# Altium schematic sheet E-43 Inertial sensor.SchDoc: E-43 Inertial Sensor
size B; DrawnBy: Jeremie Boulianne; Organization: Synthiam Inc.; Address1: Unit 10, 6120 - 11 St. SE; Address2: Calgary, AB; Address3: T2H 2L7; Address4: Canada; Revision: 0
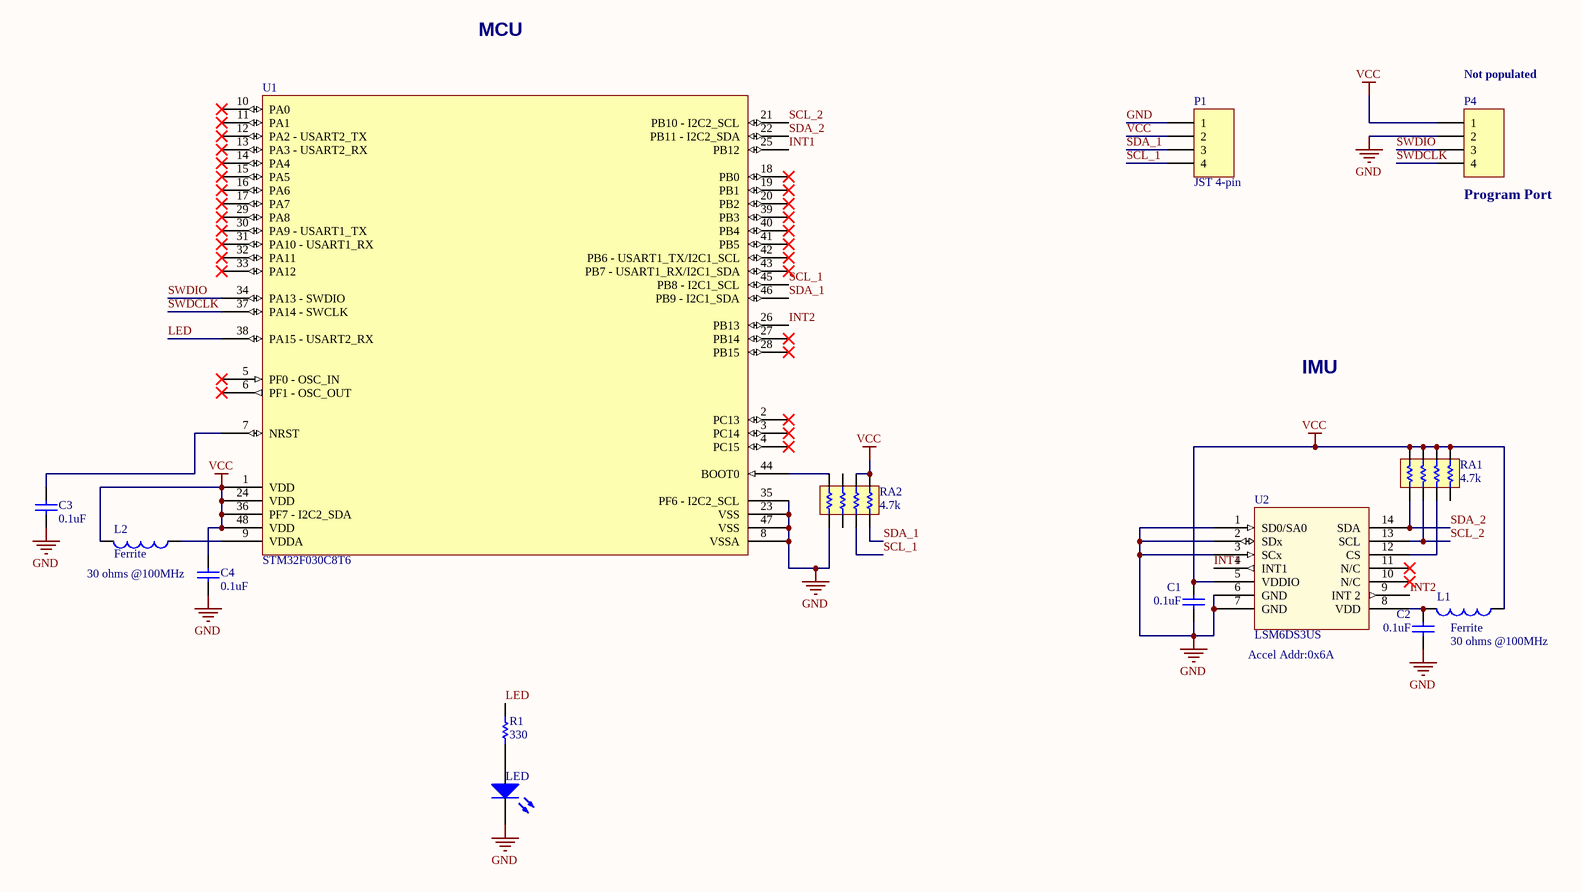
[diagram p0: E-43 Inertial sensor.SchDoc]

## Parts
C1  0.1uF  [0603 TIGHT]
C2  0.1uF  [0603 TIGHT]
C3  value 0.1uF  [0603 TIGHT]  (hidden comment: Cap)
C4  value 0.1uF  [0603 TIGHT]  (hidden comment: Cap)
L1  Ferrite  value 30 ohms @100MHz  [0603 TIGHT]
L2  Ferrite  value 30 ohms @100MHz  [0603 TIGHT]
LED  LED2  [0805 LED - TIGHT]  (value not drawn)
P1  JST 4-pin  [JST-PH 4-pin SMD]
P4  Not populated  [MINI PROG4]
R1  value 330  [0603 tight]  (hidden comment: Res1)
RA1  4.7k  [Resistor Array 4]
RA2  4.7k  [Resistor Array 4]
U1  STM32F030C8T6  [LQFP48_M]
U2  LSM6DS3US  [LSM6DS3US]

## Nets
GND: C1.1 C2.1 C3.2 C4.2 LED.2(K) P1.1 P4.2 RA2.1 U1.8(VSSA) U1.23(VSS) U1.35(PF6_-_I2C2_SCL) U1.47(VSS) U2.1(SD0/SA0) U2.2(SDx) U2.3(SCx) U2.6(GND) U2.7(GND)
VCC: C1.2 C4.1 L1.1 L2.2 P1.2 P4.1 RA1.2 RA1.4 RA1.6 RA1.8 RA2.6 RA2.8 U1.1(VDD) U1.24(VDD) U1.36(PF7_-_I2C2_SDA) U1.48(VDD) U2.5(VDDIO)
INT1: U1.25(PB12) U2.4(INT1)
INT2: U1.26(PB13) U2.9(INT_2)
LED: R1.2 U1.38(PA15_-_USART2_RX)
SCL_1: P1.4 RA2.5 U1.45(PB8_-_I2C1_SCL)
SCL_2: RA1.5 U1.21(PB10_-_I2C2_SCL) U2.13(SCL)
SDA_1: P1.3 RA2.7 U1.46(PB9_-_I2C1_SDA)
SDA_2: RA1.7 U1.22(PB11_-_I2C2_SDA) U2.14(SDA)
SWDCLK: P4.4 U1.37(PA14_-_SWCLK)
SWDIO: P4.3 U1.34(PA13_-_SWDIO)
NetC2_2: C2.2 L1.2 U2.8(VDD)
NetC3_1: C3.1 U1.7(NRST)
NetL2_1: L2.1 U1.9(VDDA)
NetLED_1: LED.1(A) R1.1
NetRA1_3: RA1.3 U2.12(CS)
NetRA2_2: RA2.2 U1.44(BOOT0)

Not connected (* = marked no-connect by the designer): RA1 1; RA2 3(5) 4(6); U1 2(PC13)* 3(PC14)* 4(PC15)* 5(PF0_-_OSC_IN)* 6(PF1_-_OSC_OUT)* 10(PA0)* 11(PA1)* 12(PA2_-_USART2_TX)* 13(PA3_-_USART2_RX)* 14(PA4)* 15(PA5)* 16(PA6)* 17(PA7)* 18(PB0)* 19(PB1)* 20(PB2)* 27(PB14)* 28(PB15)* 29(PA8)* 30(PA9_-_USART1_TX)* 31(PA10_-_USART1_RX)* 32(PA11)* 33(PA12)* 39(PB3)* 40(PB4)* 41(PB5)* 42(PB6_-_USART1_TX/I2C1_SCL)* 43(PB7_-_USART1_RX/I2C1_SDA)*; U2 10(N/C)* 11(N/C)*

## Notes on the sheet
- MCU
- (near P4) Program Port
- IMU
- (near U2) Accel Addr:0x6A
- Property of:
- Size:
- Date:
- B
- Drawn By:
- Time:
- Revision:
- Copyright © 2019 Synthiam Inc. All rights reserved.

## Library data of the parts
C1-C4 = Cap: Capacitor; Published: 8-Jun-2000; LatestRevisionDate: 17-Jul-2002; LatestRevisionNote: Re-released for DXP Platform.; PackageReference: RAD-0.3; Publisher: Altium Limited
L1 L2 = Inductor: Code_IEC: 1005; Published: 8-Jun-2000; LatestRevisionDate: 29-May-2009; LatestRevisionNote: IPC-7351 Footprint Added.; PackageReference: 0402-A; Publisher: Altium Limited; PackageDescription: Chip Inductor; Code_JEITA: 0402
LED = LED1: Typical RED GaAs LED; Published: 8-Jun-2000; LatestRevisionDate: 08-Jul-2005; LatestRevisionNote: Mech Layer 1 removed.; PackageReference: LED-1; Publisher: Altium Limited
P1 P4 = Header 4: Header, 4-Pin; LatestRevisionDate: 17-Jul-2002; LatestRevisionNote: Re-released for DXP Platform.; Publisher: Altium Limited
R1 = Res1: Resistor; Published: 8-Jun-2000; LatestRevisionDate: 17-Jul-2002; LatestRevisionNote: Re-released for DXP Platform.; PackageReference: AXIAL-0.3; Publisher: Altium Limited
RA1 RA2 = Resistor Array 4
U1 = STM32F030C8